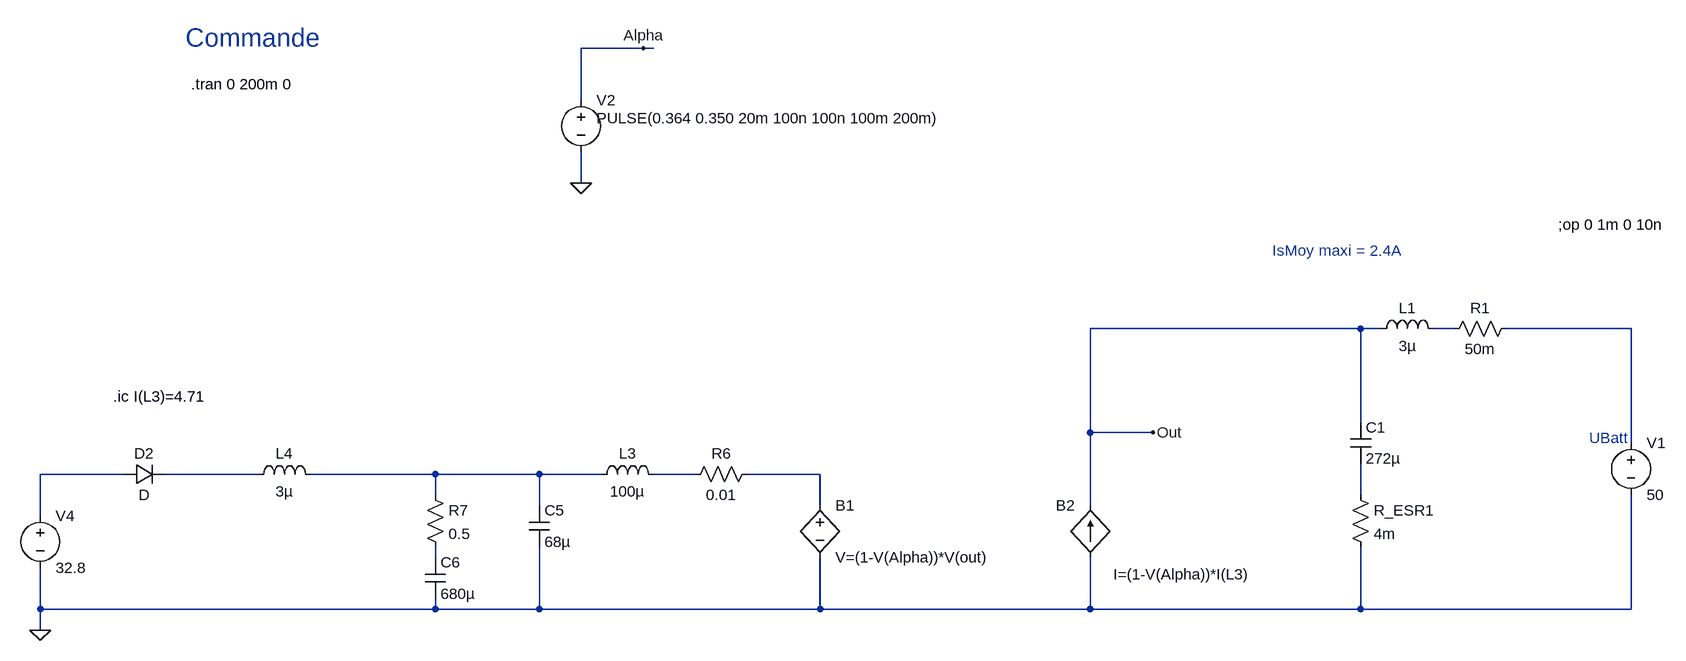
[diagram p0: schematic Boost.asc]
Boost.asc, the LTspice schematic file:
Version 4
SHEET 1 3136 1132
WIRE 128 -400 32 -400
WIRE 144 -400 128 -400
WIRE 32 -320 32 -400
WIRE 32 -192 32 -240
WIRE 1232 32 816 32
WIRE 1264 32 1232 32
WIRE 1376 32 1344 32
WIRE 1648 32 1456 32
WIRE 1232 176 1232 32
WIRE 816 192 816 32
WIRE 912 192 816 192
WIRE 1648 208 1648 32
WIRE -672 256 -800 256
WIRE -464 256 -608 256
WIRE -192 256 -384 256
WIRE -32 256 -192 256
WIRE 64 256 -32 256
WIRE 208 256 144 256
WIRE 400 256 288 256
WIRE -192 288 -192 256
WIRE 1232 288 1232 240
WIRE -32 304 -32 256
WIRE 400 304 400 256
WIRE 816 304 816 192
WIRE -800 320 -800 256
WIRE -192 384 -192 368
WIRE -800 464 -800 400
WIRE -192 464 -192 448
WIRE -192 464 -800 464
WIRE -32 464 -32 368
WIRE -32 464 -192 464
WIRE 400 464 400 384
WIRE 400 464 -32 464
WIRE 816 464 816 384
WIRE 816 464 400 464
WIRE 1232 464 1232 368
WIRE 1232 464 816 464
WIRE 1648 464 1648 288
WIRE 1648 464 1232 464
WIRE -800 496 -800 464
FLAG 912 192 Out
FLAG 32 -192 0
FLAG 128 -400 Alpha
FLAG -800 496 0
SYMBOL bv 400 288 R0
SYMATTR InstName B1
SYMATTR Value V=(1-V(Alpha))*V(out)
SYMBOL bi 816 384 R180
WINDOW 0 24 80 Left 2
WINDOW 3 -248 -26 Left 2
SYMATTR InstName B2
SYMATTR Value I=(1-V(Alpha))*I(L3)
SYMBOL voltage 32 -336 R0
WINDOW 123 0 0 Left 0
WINDOW 39 0 0 Left 0
WINDOW 3 24 44 Left 2
SYMATTR InstName V2
SYMATTR Value PULSE(0.364 0.350 20m 100n 100n 100m 200m)
SYMBOL ind 48 272 R270
WINDOW 0 32 56 VTop 2
WINDOW 3 5 56 VBottom 2
SYMATTR InstName L3
SYMATTR Value 100µ
SYMBOL res 304 240 R90
WINDOW 0 0 56 VBottom 2
WINDOW 3 32 56 VTop 2
SYMATTR InstName R6
SYMATTR Value 0.01
SYMBOL voltage -800 304 R0
WINDOW 123 0 0 Left 2
WINDOW 39 0 0 Left 2
SYMATTR InstName V4
SYMATTR Value 32.8
SYMBOL cap -48 304 R0
SYMATTR InstName C5
SYMATTR Value 68µ
SYMBOL ind -480 272 R270
WINDOW 0 32 56 VTop 2
WINDOW 3 5 56 VBottom 2
SYMATTR InstName L4
SYMATTR Value 3µ
SYMBOL res -208 272 R0
SYMATTR InstName R7
SYMATTR Value 0.5
SYMBOL cap -208 384 R0
SYMATTR InstName C6
SYMATTR Value 680µ
SYMBOL diode -672 272 R270
WINDOW 0 32 32 VTop 2
WINDOW 3 0 32 VBottom 2
SYMATTR InstName D2
SYMBOL voltage 1648 192 R0
WINDOW 123 0 0 Left 2
WINDOW 39 0 0 Left 2
SYMATTR InstName V1
SYMATTR Value 50
SYMBOL cap 1216 176 R0
SYMATTR InstName C1
SYMATTR Value 272µ
SYMBOL res 1216 272 R0
SYMATTR InstName R_ESR1
SYMATTR Value 4m
SYMBOL res 1472 16 R90
WINDOW 0 0 56 VBottom 2
WINDOW 3 32 56 VTop 2
SYMATTR InstName R1
SYMATTR Value 50m
SYMBOL ind 1248 48 R270
WINDOW 0 32 56 VTop 2
WINDOW 3 5 56 VBottom 2
SYMATTR InstName L1
SYMATTR Value 3µ
TEXT -568 -344 Left 2 !.tran 0 200m 0
TEXT -576 -416 Left 4 ;Commande
TEXT -688 136 Left 2 !.ic I(L3)=4.71
TEXT 1584 200 Left 2 ;UBatt
TEXT 1536 -128 Left 2 !;op 0 1m 0 10n
TEXT 1096 -88 Left 2 ;IsMoy maxi = 2.4A

The netlist it stands for:
* Boost.asc
B1 N007 0 V=(1-V(Alpha))*V(out)
B2 0 Out I=(1-V(Alpha))*I(L3)
V2 Alpha 0 PULSE(0.364 0.350 20m 100n 100n 100m 200m)
L3 N005 N006 100µ
R6 N007 N006 0.01
V4 N003 0 32.8
C5 N005 0 68µ
L4 N004 N005 3µ
R7 N005 N009 0.5
C6 N009 0 680µ
D2 N003 N004 D
V1 N002 0 50
C1 Out N008 272µ
R_ESR1 N008 0 4m
R1 N002 N001 50m
L1 Out N001 3µ
.model D D
.lib standard.dio
.tran 0 200m 0
* Commande
.ic I(L3)=4.71
* UBatt
;op 0 1m 0 10n
* IsMoy maxi = 2.4A
.backanno
.end